# EAGLE schematic Lyrebird0.2 (EAGLE 7.6.0)
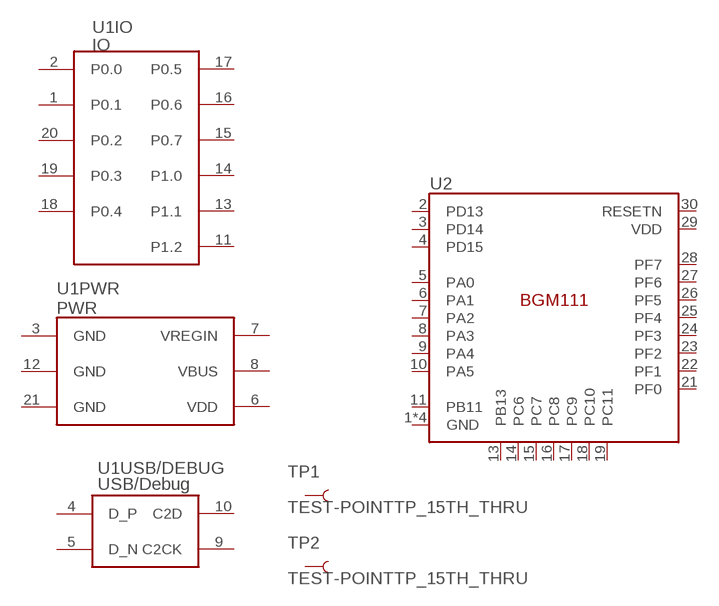
[diagram p0: schematic, sheet 1]

## Parts
TP1  TEST-POINTTP_15TH_THRU  [TP_15TH]
TP2  TEST-POINTTP_15TH_THRU  [TP_15TH]
U1  EMF8UB1  [SILABS-QFN20]
U2  BGM111  [BGM111]
Unconnected: TP1.P$1 TP2.P$1 U1.1(IO:P0.1) U1.2(IO:P0.0) U1.3(PWR:GND) U1.4(USB/DEBUG:D_P) U1.5(USB/DEBUG:D_N) U1.6(PWR:VDD) U1.7(PWR:VREGIN) U1.8(PWR:VBUS) U1.9(USB/DEBUG:C2CK) U1.10(USB/DEBUG:C2D) U1.11(IO:P1.2) U1.12(PWR:GND) U1.13(IO:P1.1) U1.14(IO:P1.0) U1.15(IO:P0.7) U1.16(IO:P0.6) U1.17(IO:P0.5) U1.18(IO:P0.4) U1.19(IO:P0.3) U1.20(IO:P0.2) U1.21(PWR:GND) U2.1(GND) U2.2(PD13) U2.3(PD14) U2.4(PD15) U2.5(PA0) U2.6(PA1) U2.7(PA2) U2.8(PA3) U2.9(PA4) U2.10(PA5) U2.11(PB11) U2.12(GND) U2.13(PB13) U2.14(PC6) U2.15(PC7) U2.16(PC8) U2.17(PC9) U2.18(PC10) U2.19(PC11) U2.20(GND) U2.21(PF0) U2.22(PF1) U2.23(PF2) U2.24(PF3) U2.25(PF4) U2.26(PF5) U2.27(PF6) U2.28(PF7) U2.29(VDD) U2.30(RESETN) U2.31(GND)

## Library data of the parts
TP1 TP2 = SparkFun-Connectors:TEST-POINT: SparkFun Test Points Bare copper test points for troubleshooting or In-Circuit-Testing. These are used by our Production team for verifying production board runs using pogo-pins on test beds. SparkFun Products: SparkFun LSM9DS1 Breakout <https://www.sparkfun.com/products/13284> SparkFun PSOC <https://www.sparkfun.com/products/13714> SparkFun Load Cell Amplifier <https://www.sparkfun.com/products/13879>
U1 = SpaceY:EMF8UB1
U2 = LB-RF:BGM111